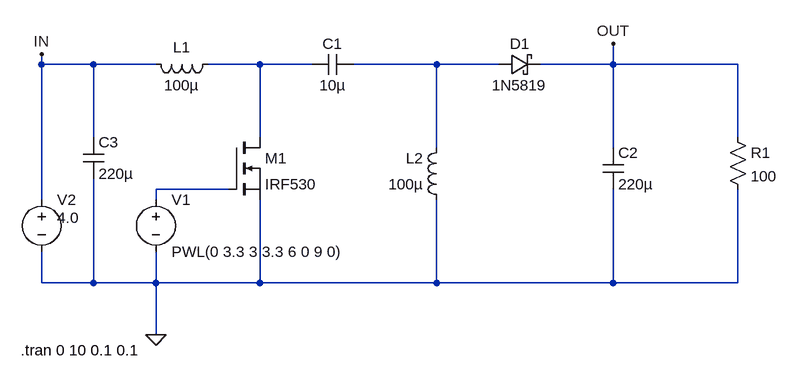
[diagram p0: schematic SEPIC.asc]
SEPIC.asc, the LTspice schematic file:
Version 4
SHEET 1 1092 680
WIRE -48 -464 -48 -480
WIRE 32 -464 -48 -464
WIRE 128 -464 32 -464
WIRE 288 -464 208 -464
WIRE 368 -464 288 -464
WIRE 560 -464 432 -464
WIRE 656 -464 560 -464
WIRE 832 -464 832 -496
WIRE 832 -464 720 -464
WIRE 1024 -464 832 -464
WIRE 32 -352 32 -464
WIRE 288 -352 288 -464
WIRE 1024 -352 1024 -464
WIRE 560 -336 560 -464
WIRE 832 -336 832 -464
WIRE 240 -272 128 -272
WIRE -48 -256 -48 -464
WIRE 128 -256 128 -272
WIRE -48 -128 -48 -176
WIRE 32 -128 32 -288
WIRE 32 -128 -48 -128
WIRE 128 -128 128 -176
WIRE 128 -128 32 -128
WIRE 288 -128 288 -256
WIRE 288 -128 128 -128
WIRE 560 -128 560 -256
WIRE 560 -128 288 -128
WIRE 832 -128 832 -272
WIRE 832 -128 560 -128
WIRE 1024 -128 1024 -272
WIRE 1024 -128 832 -128
WIRE 128 -48 128 -128
FLAG 128 -48 0
FLAG 832 -496 OUT
FLAG -48 -480 IN
SYMBOL ind 224 -480 R90
WINDOW 0 5 56 VBottom 2
WINDOW 3 32 56 VTop 2
SYMATTR InstName L1
SYMATTR Value 100µ
SYMBOL ind 576 -240 R180
WINDOW 0 36 80 Left 2
WINDOW 3 36 40 Left 2
SYMATTR InstName L2
SYMATTR Value 100µ
SYMBOL nmos 240 -352 R0
SYMATTR InstName M1
SYMATTR Value IRF530
SYMBOL cap 432 -480 R90
WINDOW 0 0 32 VBottom 2
WINDOW 3 32 32 VTop 2
SYMATTR InstName C1
SYMATTR Value 10µ
SYMBOL schottky 656 -448 R270
WINDOW 0 32 32 VTop 2
WINDOW 3 0 32 VBottom 2
SYMATTR InstName D1
SYMATTR Value 1N5819
SYMATTR Description Diode
SYMATTR Type diode
SYMBOL cap 816 -336 R0
SYMATTR InstName C2
SYMATTR Value 220µ
SYMBOL voltage 128 -272 R0
WINDOW 123 0 0 Left 0
WINDOW 39 0 0 Left 0
SYMATTR InstName V1
SYMATTR Value PWL(0 3.3 3 3.3 6 0 9 0)
SYMBOL voltage -48 -272 R0
WINDOW 123 0 0 Left 0
WINDOW 39 0 0 Left 0
WINDOW 3 24 44 Left 2
SYMATTR Value 4.0
SYMATTR InstName V2
SYMBOL res 1008 -368 R0
SYMATTR InstName R1
SYMATTR Value 100
SYMBOL cap 16 -352 R0
SYMATTR InstName C3
SYMATTR Value 220µ
TEXT -80 -24 Left 2 !.tran 0 10 0.1 0.1

The netlist it stands for:
* SEPIC.asc
L1 N001 IN 100µ
L2 0 N002 100µ
M1 N001 N003 0 0 IRF530
C1 N002 N001 10µ
D1 N002 OUT 1N5819
C2 OUT 0 220µ
V1 N003 0 PWL(0 3.3 3 3.3 6 0 9 0)
V2 IN 0 4.0
R1 OUT 0 100
C3 IN 0 220µ
.model D D
.lib standard.dio
.model NMOS NMOS
.model PMOS PMOS
.lib standard.mos
.tran 0 10 0.1 0.1
.backanno
.end